# EAGLE design MainBoard (EAGLE 7.7.0)
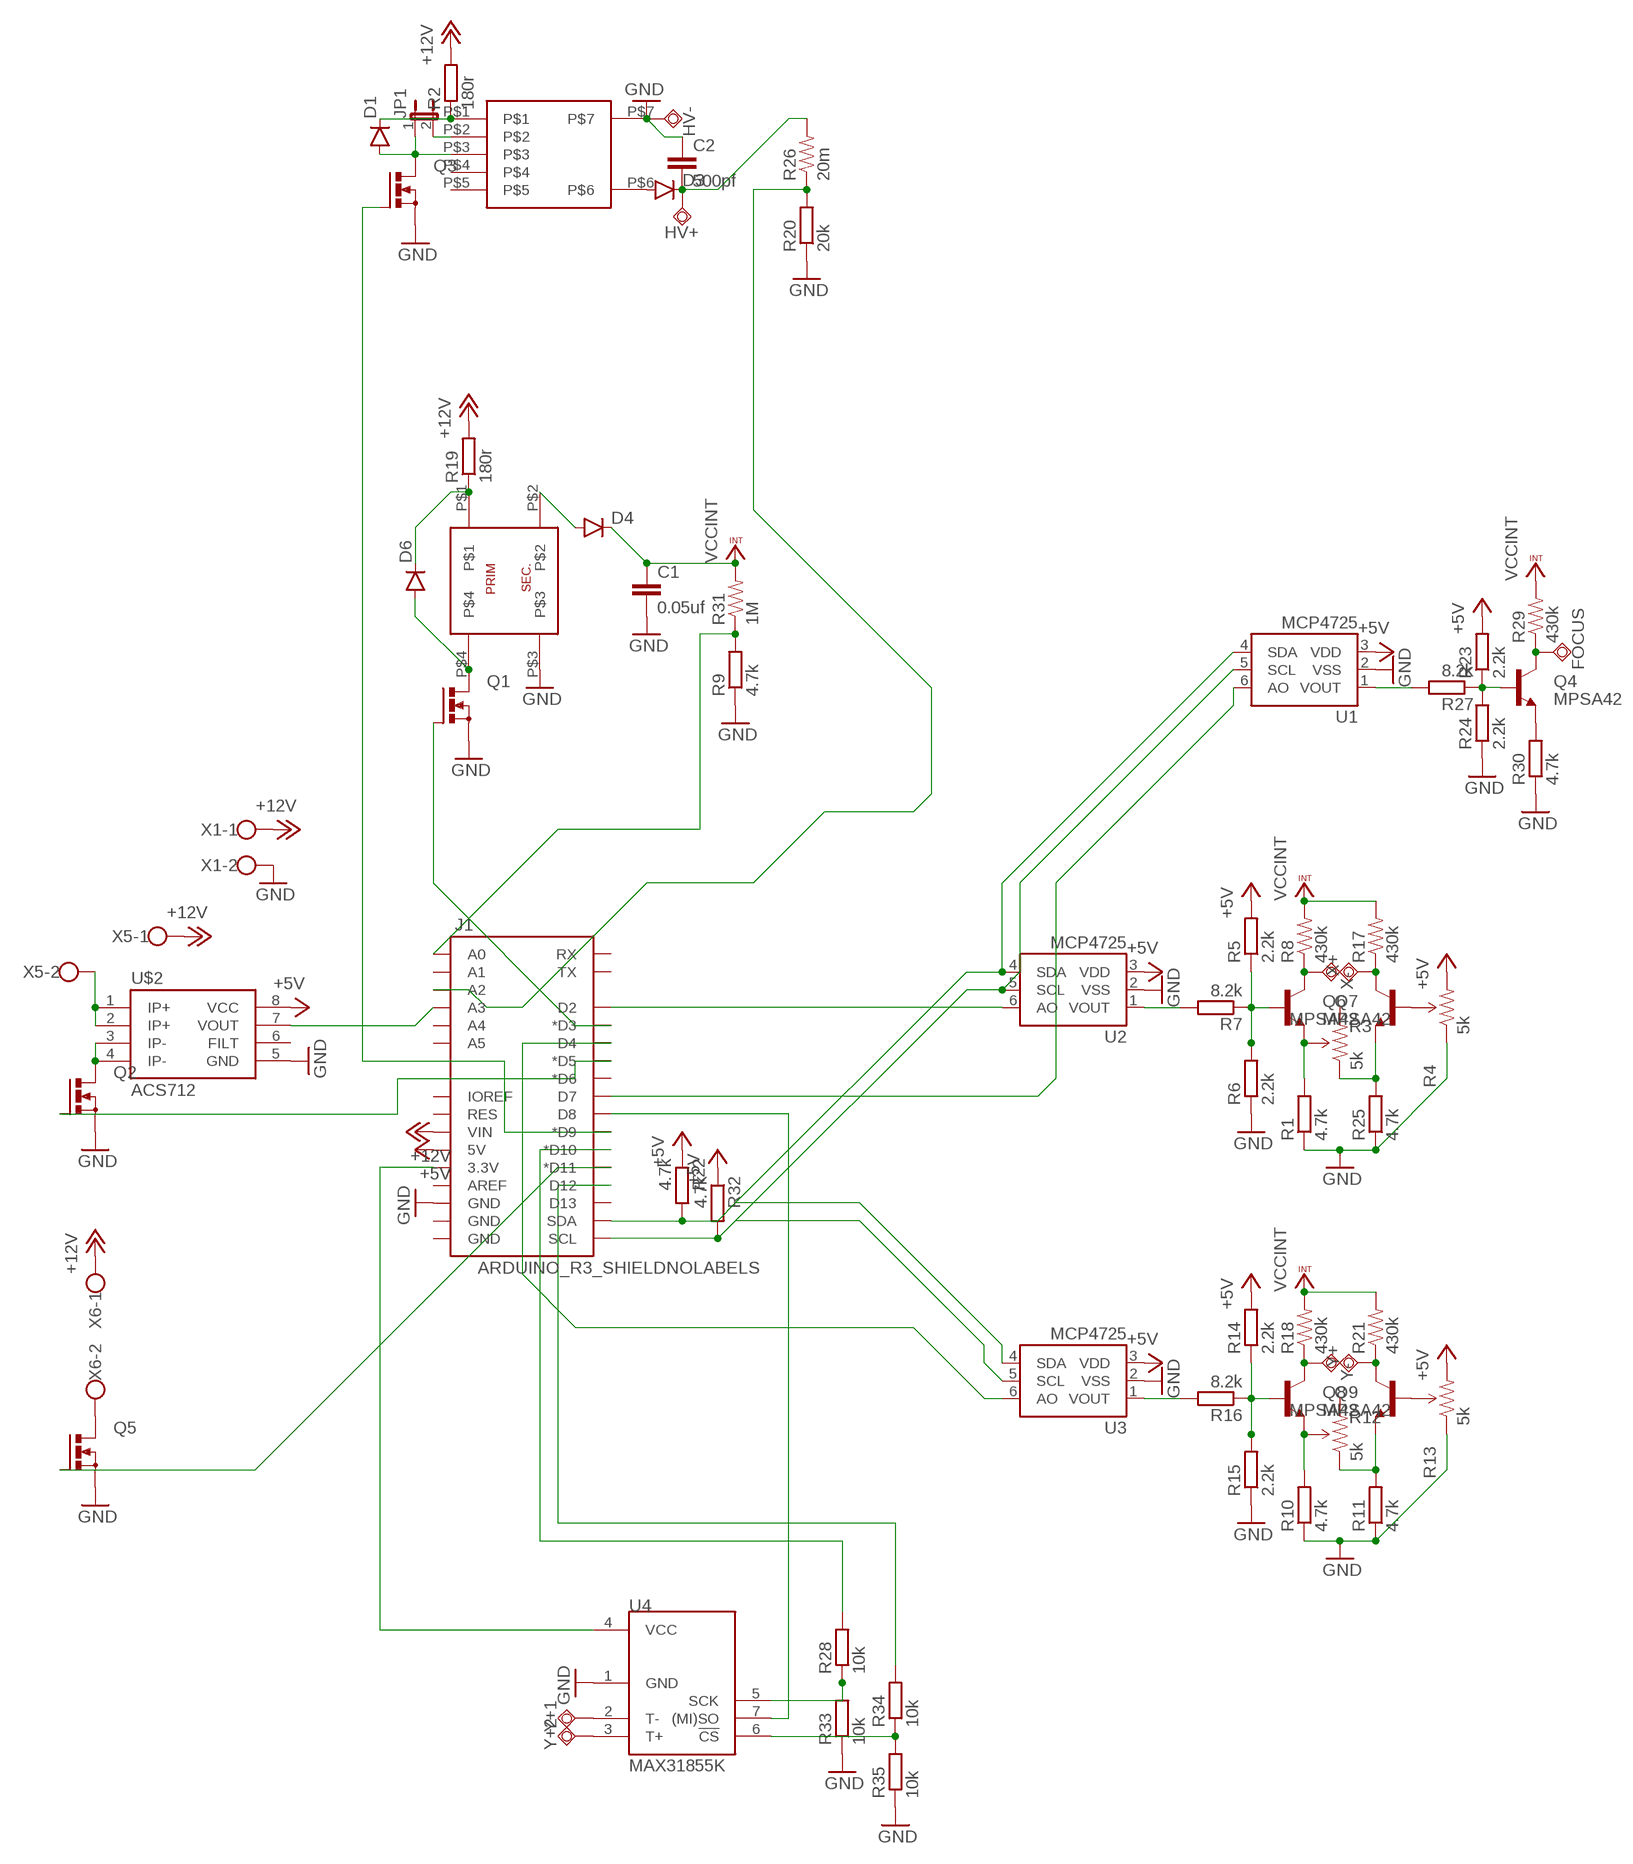
[diagram p0: schematic, sheet 1]

## Parts
C1  0.05uf  CC1206  [C1206]
C2  500pf  CC1206  [C1206]
D1  DIODESOD123  [SOD-123]
D3  DIODEPTH  [DIODE-1N4001]
D4  DIODESOD123  [SOD-123]
D6  DIODESOD123  [SOD-123]
FOCUS  FOCUS  TPSQPAD1-13  [P1-13]
HV+  TPSQPAD1-13  [P1-13]
HV-  TPSQPAD1-13  [P1-13]
J1  ARDUINO_R3_SHIELDNOLABELS  [UNO_R3_SHIELD_NOLABELS]
JP1  JUMPER-2SMD-NO  [SJ_2S-NO]
Q1  N-MOSFET-SO8S  [SO-08]
Q2  N-MOSFET-SO8S  [SO-08]
Q3  N-MOSFET-SO8S  [SO-08]
Q4  MPSA42  TRANSISTOR_NPNMPSA42  [SOT23-3]
Q5  N-MOSFET-SO8S  [SO-08]
Q6  MPSA42  TRANSISTOR_NPNMPSA42  [SOT23-3]
Q7  MPSA42  TRANSISTOR_NPNMPSA42  [SOT23-3]
Q8  MPSA42  TRANSISTOR_NPNMPSA42  [SOT23-3]
Q9  MPSA42  TRANSISTOR_NPNMPSA42  [SOT23-3]
R1  4.7k  R-EU_R0603  [R0603]
R2  180r  R-EU_R0603  [R0603]
R3  5k  TRIMPOTTRIMPOT_PTH_S3_LOCK  [TRIMPOT_PTH_S3_LOCK]
R4  5k  TRIMPOTTRIMPOT_PTH_S3_LOCK  [TRIMPOT_PTH_S3_LOCK]
R5  2.2k  R-EU_R0603  [R0603]
R6  2.2k  R-EU_R0603  [R0603]
R7  8.2k  R-EU_R0603  [R0603]
R8  430k  RESISTOR1206  [1206]
R9  4.7k  R-EU_R0603  [R0603]
R10  4.7k  R-EU_R0603  [R0603]
R11  4.7k  R-EU_R0603  [R0603]
R12  5k  TRIMPOTTRIMPOT_PTH_S3_LOCK  [TRIMPOT_PTH_S3_LOCK]
R13  5k  TRIMPOTTRIMPOT_PTH_S3_LOCK  [TRIMPOT_PTH_S3_LOCK]
R14  2.2k  R-EU_R0603  [R0603]
R15  2.2k  R-EU_R0603  [R0603]
R16  8.2k  R-EU_R0603  [R0603]
R17  430k  RESISTOR1206  [1206]
R18  430k  RESISTOR1206  [1206]
R19  180r  R-EU_R0603  [R0603]
R20  20k  R-EU_R0603  [R0603]
R21  430k  RESISTOR1206  [1206]
R22  4.7k  R-EU_R0603  [R0603]
R23  2.2k  R-EU_R0603  [R0603]
R24  2.2k  R-EU_R0603  [R0603]
R25  4.7k  R-EU_R0603  [R0603]
R26  20m  RESISTORPTH-1/4W  [AXIAL-0.4]
R27  8.2k  R-EU_R0603  [R0603]
R28  10k  R-EU_R0603  [R0603]
R29  430k  RESISTOR1206  [1206]
R30  4.7k  R-EU_R0603  [R0603]
R31  1M  RESISTOR1206  [1206]
R32  4.7k  R-EU_R0603  [R0603]
R33  10k  R-EU_R0603  [R0603]
R34  10k  R-EU_R0603  [R0603]
R35  10k  R-EU_R0603  [R0603]
U1  MCP4725  MCP4725SOT-23  [SOT23-6]
U2  MCP4725  MCP4725SOT-23  [SOT23-6]
U3  MCP4725  MCP4725SOT-23  [SOT23-6]
U4  MAX31855K  [SOIC8]
U$1  ATB  [ATB3225]
U$2  ACS712  [SO08]
U$3  CTX  [CTX]
X1  W237-102  [W237-102]
X5  W237-102  [W237-102]
X6  W237-102  [W237-102]
X+  TPSQPAD1-13  [P1-13]
X-  TPSQPAD1-13  [P1-13]
Y+  TPSQPAD1-13  [P1-13]
Y+1  TPSQPAD1-13  [P1-13]
Y+2  TPSQPAD1-13  [P1-13]
Y-  TPSQPAD1-13  [P1-13]

## Nets
+5V: J1.5V R4.3(CW) R5.2 R13.3(CW) R14.2 R22.1 R23.2 R32.1 U1.3(VDD) U2.3(VDD) U3.3(VDD) U$2.8(VCC)
+12V: J1.VIN R2.2 R19.2 X1.1 X5.1 X6.1
GND: C1.2 C2.1 HV-.TP J1.GND@2(GND) Q1.1(S) Q1.2(S) Q1.3(S) Q2.1(S) Q2.2(S) Q2.3(S) Q3.1(S) Q3.2(S) Q3.3(S) Q5.1(S) Q5.2(S) Q5.3(S) R1.1 R4.1(CCW) R6.1 R9.1 R10.1 R11.1 R13.1(CCW) R15.1 R20.1 R24.1 R25.1 R30.1 R33.1 R35.1 U1.2(VSS) U2.2(VSS) U3.2(VSS) U4.1(GND) U$1.P$3 U$2.5(GND) U$3.P$7 X1.2
N$1 [med]: Q6.3(C) R8.1 X-.TP
N$2 [med]: Q7.3(C) R17.1 X+.TP
N$3: R7.2 U2.1(VOUT)
N$4: Q6.2(E) R1.2 R3.2(WIPER)
N$5: Q7.2(E) R3.1(CCW) R25.2
N$6: Q7.1(B) R4.2(WIPER)
N$7: Q9.1(B) R13.2(WIPER)
N$8: Q6.1(B) R5.1 R6.2 R7.1
N$9: Q4.2(E) R30.2
N$10: J1.D3(*D3) Q1.4(G)
N$11: Q8.2(E) R10.2 R12.2(WIPER)
N$12: Q9.2(E) R11.2 R12.1(CCW)
N$13: J1.SDA R22.2 U1.4(SDA) U2.4(SDA) U3.4(SDA)
N$14: Q8.1(B) R14.1 R15.2 R16.1
N$15 [med]: Q9.3(C) R21.1 Y+.TP
N$16 [med]: Q8.3(C) R18.1 Y-.TP
N$17: R16.2 U3.1(VOUT)
N$18: J1.D2 U2.6(AO)
N$19: J1.D4 U3.6(AO)
N$20: J1.A0 R9.2 R31.1
N$21: D6.A Q1.5(D) Q1.6(D) Q1.7(D) Q1.8(D) U$1.P$4
N$22 [med]: D4.A U$1.P$2
N$23: Q2.5(D) Q2.6(D) Q2.7(D) Q2.8(D) U$2.3(IP-) U$2.4(IP-)
N$24: U$2.1(IP+) U$2.2(IP+) X5.2
N$25: J1.D5(*D5) Q2.4(G)
N$26: D1.A JP1.1 Q3.5(D) Q3.6(D) Q3.7(D) Q3.8(D) U$3.P$3
N$27: JP1.2 U$3.P$2
N$28: D1.C R2.1 U$3.P$1
N$29 [hv]: D3.A U$3.P$6
N$30 [hv]: C2.2 D3.C HV+.TP R26.P$2
N$31: R28.1 R33.2 U4.5(SCK)
N$32: D6.C R19.1 U$1.P$1
N$33: Q4.1(B) R23.1 R24.2 R27.1
N$34: R27.2 U1.1(VOUT)
N$35: J1.SCL R32.2 U1.5(SCL) U2.5(SCL) U3.5(SCL)
N$36: FOCUS.TP Q4.3(C) R29.1
N$37: R34.1 R35.2 U4.6(!CS)
N$38: J1.D9(*D9) Q3.4(G)
N$39: J1.D10(*D10) R28.2
N$40: J1.A2 R20.2 R26.P$1
N$41 [med]: Q5.5(D) Q5.6(D) Q5.7(D) Q5.8(D) X6.2
N$42: J1.D11(*D11) Q5.4(G)
N$43: J1.A3 U$2.7(VOUT)
N$44: J1.D12 R34.2
N$45: J1.D7 U1.6(AO)
N$46: J1.D8 U4.7((MI)SO)
N$47: U4.2(T-) Y+1.TP
N$48: U4.3(T+) Y+2.TP
N$49: J1.3.3V U4.4(VCC)
VCCINT [med]: C1.1 D4.C R8.2 R17.2 R18.2 R21.2 R29.2 R31.2
Unconnected: J1.A1 J1.A4 J1.A5 J1.AREF J1.D6(*D6) J1.D13 J1.GND@0(GND) J1.GND@1(GND) J1.IOREF J1.RES J1.RX J1.TX R3.3(CW) R12.3(CW) U$2.6(FILT) U$3.P$4 U$3.P$5

## Library data of the parts
C1 C2 = eagle-ltspice:C: CAPACITOR, European symbol; SPICEMODEL: NONE; SPICEPREFIX: C
D1 D3 D4 D6 = SparkFun-DiscreteSemi:DIODE: Diode These are standard reverse protection diodes and small signal diodes. SMA package can handle up to about 1A. SOD-323 can handle about 200mA. What the SOD-323 package when ordering, there are some mfgs out there that are 5-pin packages.
FOCUS HV+ HV- X+ X- Y+ Y+1 Y+2 Y- = testpad:TPSQ: Test pad
J1 = SparkFun-Boards:ARDUINO_R3_SHIELD: Shield form compatible with the Arduino Uno R3.
JP1 = SparkFun-Retired:JUMPER-2: Jumper Basic 0.1" spaced jumper. Use with breakaway headers.
Q1-Q3 Q5 = transistor-power:N-MOSFET-SO8: N-Channel MOSFET Example: FDS7760A; N-Channel Logic Level PowerTrench® MOSFET FDS2572; N-Channel UltraFET® Trench MOSFET Source: www.fairchildsemi.com
Q4 Q6-Q9 = SparkFun-DiscreteSemi:TRANSISTOR_NPN: Generic NPN BJT MMBT2222A - TRANS-08049 (SOT-23, 1A 40V) MPSA42 - TRANS-09116 (SOT-23, 500mA 300V) MMBT5088LT1G - TRANS-11160 (SOT-23, 50 mA 30V) BC547 - COM-08928 <http://www.sparkfun.com/products/8928> (TO-92 45V 100mA) (1.Collector 2.Base 3.Emitter) 2N3904 - COM-00521 <http://www.sparkfun.com/products/521> (TO-92 40V 200mA) (1.Emitter 2.Base 3.Collector) P2N2222A - COM-12852 <http://www.sparkfun.com/products/12852> (TO-92 40V 600mA) (1.Collector 2.Base 3.Emitter); PROD_ID: TRANS-09116
R1 R2 R5-R7 R9-R11 R14-R16 R19 R20 R22-R25 R27 R28 R30 R32-R35 = rcl:R-EU_: RESISTOR, European symbol
R3 R4 R12 R13 = SparkFun-Electromechanical:TRIMPOT: Various small potentiometers for "set-and-forget" applications
R8 R17 R18 R21 R26 R29 R31 = SparkFun-Resistors:RESISTOR: Resistor Basic schematic elements and footprints for 0603, 1206, and PTH resistors.
U1-U3 = SparkFun-AnalogIC:MCP4725: Microchip 12-bit I2C DAC, SOT23-6; PROD_ID: IC-08886
U4 = SparkFun-AnalogIC:MAX31855K: Cold-Junction-Compensated K-Thermocoupleto-Digital Converter (-270°C to +1800°C) The MAX31855K performs cold-junction compensation and digitizes the signal from a type-K thermocouple. The data is output in a 14-bit resolution, SPI™-compatible, read-only format. This converter resolves temperatures to 0.25°C, allows readings as high as +1800°C and as low as -270°C, and exhibits thermocouple accuracy of ±2°C for temperatures ranging from -200°C to +700°C for K-type thermocouples.
U$1 = TheLibrary:ATB
U$2 = SparkFun-AnalogIC:ACS712: Hall-effect-based isolated linear current sensor; PROD_ID: IC-08964
U$3 = TheLibrary:CTX
X1 X5 X6 = con-wago-500:W237-102: WAGO SCREW CLAMP; MPN: 237-102; OC_FARNELL: unknown; OC_NEWARK: 70K9898

## Net classes
1 med: width 0.254 mm, clearance 1.27 mm
2 hv: width 0.254 mm, clearance 3.81 mm

## Board
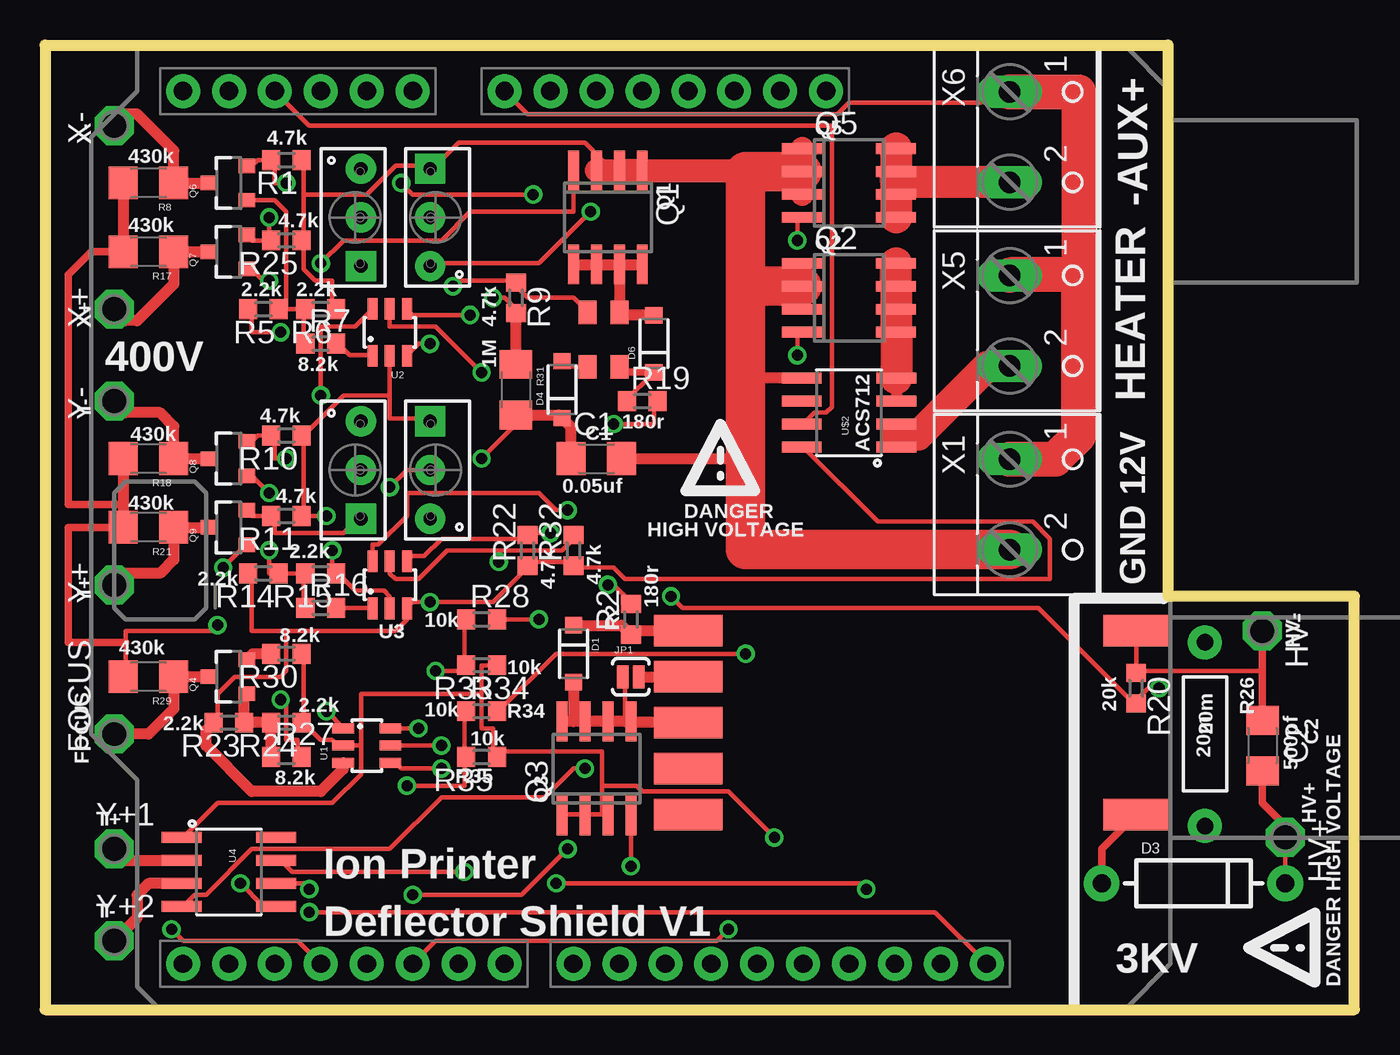
[diagram p1: board, top side]
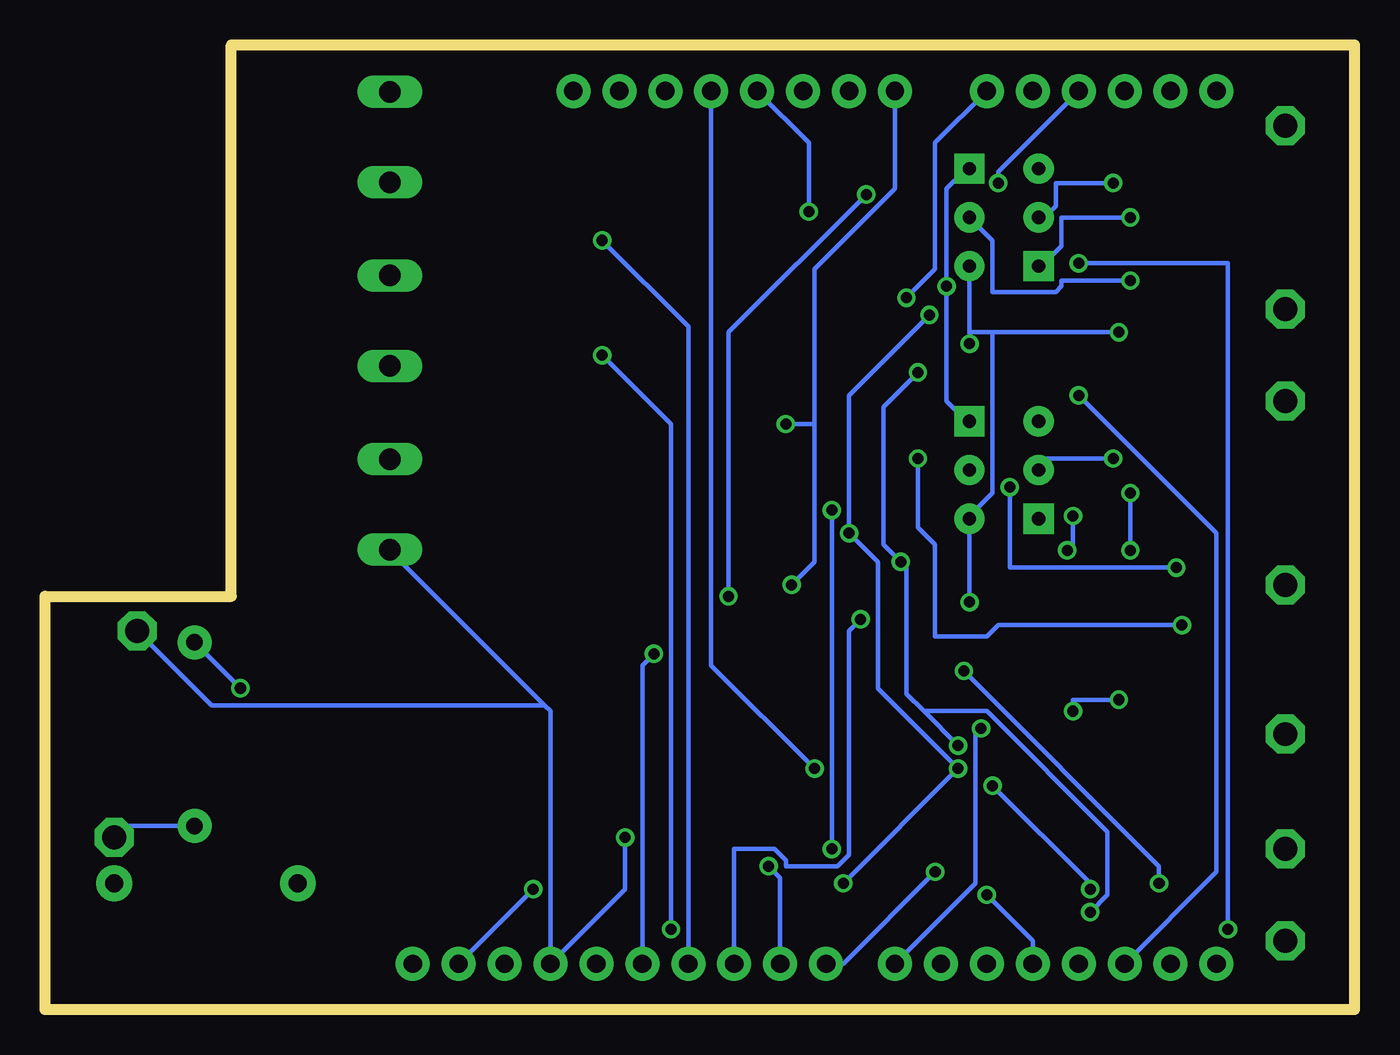
[diagram p2: board, bottom side, seen from below]

Size 72.39 x 53.34 mm. Coordinates in mm from the lower left corner, seen from the top.
Outline: 0,53.34 0,0 72.39,0 72.39,22.86 62.1,22.86 62.1,53.34 0,53.34
Copper layers (1*16): Top 0.035mm / dielectric 1.5mm / Bottom 0.035mm
Design rules "default": minimum track width 10mil, minimum drill 24mil, track to track 8mil, track to pad 8mil, pad to pad 8mil, via to via 8mil, smd to smd 8mil, copper to edge 40mil, drill to drill 8mil, minimum pad ring 10mil, minimum via ring 8mil, stop-mask expansion 4mil, vias tented up to drill 0mil, thermal gap 10mil

### Footprints (pad centres in the part's own frame; a part is rotated, then mirrored left to right if it is on the bottom)
C1206 = smd 1.6 x 1.8: 1 -1.4,0; 2 1.4,0
SOD-123 = smd 0.9 x 0.95: A 1.575,0; C -1.575,0
DIODE-1N4001 = drill 1 pad 1.981: A -5.08,0; C 5.08,0
P1-13 = drill 1.321 pad 2.159 octagon: TP 0,0
UNO_R3_SHIELD_NOLABELS = drill 1.016 pad 1.88: 3.3V 50.8,26.67; 5V 50.8,29.21; A0 50.8,41.91; A1 50.8,44.45; A2 50.8,46.99; A3 50.8,49.53; A4 50.8,52.07; A5 50.8,54.61; AREF 2.54,15.24; D2 2.54,49.53; D3 2.54,46.99; D4 2.54,44.45; D5 2.54,41.91; D6 2.54,39.37; D7 2.54,36.83; D8 2.54,33.02; D9 2.54,30.48; D10 2.54,27.94; D11 2.54,25.4; D12 2.54,22.86; D13 2.54,20.32; GND@0 50.8,31.75; GND@1 50.8,34.29; GND@2 2.54,17.78; IOREF 50.8,21.59; NC 50.8,19.05; RES 50.8,24.13; RX 2.54,54.61; SCL 2.54,10.16; SDA 2.54,12.7; TX 2.54,52.07; VIN 50.8,36.83
SJ_2S-NO = smd 0.635 x 1.27: 1 -0.45,0; 2 0.45,0
SO-08 = smd 0.6 x 2.2: 1 -1.905,-2.6; 2 -0.635,-2.6; 3 0.635,-2.6; 4 1.905,-2.6; 5 1.905,2.6; 6 0.635,2.6; 7 -0.635,2.6; 8 -1.905,2.6
SOT23-3 = smd 0.8 x 0.9: 1 -0.95,-1; 2 0.95,-1; 3 0,1.1
R0603 = smd 1 x 1.1: 1 -0.85,0; 2 0.85,0
TRIMPOT_PTH_S3_LOCK = drill 0.737 pad 1.676 square: 1 -2.692,-0.305 | drill 0.737 pad 1.676: 2 0,-0.305; 3 2.692,-0.305
1206 = smd 1.6 x 1.8: 1 -1.4,0; 2 1.4,0
AXIAL-0.4 = drill 0.9 pad 1.88: P$1 -5.08,0; P$2 5.08,0
SOT23-6 = smd 0.55 x 1.2: 1 0.95,1.3; 2 0,1.3; 3 -0.95,1.3; 4 -0.95,-1.3; 5 0,-1.3; 6 0.95,-1.3
SOIC8 = smd 0.61 x 2.21: 1 -1.905,-2.616; 2 -0.635,-2.616; 3 0.635,-2.616; 4 1.905,-2.616; 5 1.905,2.616; 6 0.635,2.616; 7 -0.635,2.616; 8 -1.905,2.616
ATB3225 = smd 1.3 x 1: P$1 0,0; P$2 0,1.75; P$3 3,1.75; P$4 3,0
SO08 = smd 0.61 x 2.21: 1 -1.905,-2.616; 2 -0.635,-2.616; 3 0.635,-2.616; 4 1.905,-2.616; 5 1.905,2.616; 6 0.635,2.616; 7 -0.635,2.616; 8 -1.905,2.616
CTX = smd 1.74 x 3.8: P$1 0,0; P$2 2.54,0; P$3 5.08,0; P$4 7.62,0; P$5 10.16,0; P$6 10.16,24.85; P$7 0,24.85
W237-102 = drill 1.194 long: 1 -2.5,-1.27; 2 2.5,-1.27

### Placement (x,y rotation side)
C1  30.48,30.48 0 top
C2  67.31,14.6 270 top
D1  29.21,19.69 270 top
D3  63.5,6.98 0 top
D4  28.57,34.29 90 top
D6  33.65,36.83 90 top
FOCUS  3.81,15.24 90 top
HV+  68.58,9.53 270 top
HV-  67.31,20.95 270 top
J1  62.23,0 90 top
JP1  32.38,18.41 0 top
Q1  31.11,43.82 180 top
Q2  44.45,39.37 270 top
Q3  30.48,13.33 0 top
Q4  10.16,18.41 90 top
Q5  44.45,45.72 270 top
Q6  10.16,45.72 90 top
Q7  10.16,41.91 90 top
Q8  10.16,30.48 90 top
Q9  10.16,26.67 90 top
R1  13.34,46.99 180 top
R2  32.38,21.59 90 top
R3  17.14,43.82 90 top
R4  21.59,43.82 270 top
R5  12.07,38.73 180 top
R6  15.24,38.73 180 top
R7  15.24,36.83 0 top
R8  5.71,45.72 180 top
R9  26.04,39.37 270 top
R10  13.34,31.75 180 top
R11  13.34,27.3 180 top
R12  17.14,29.84 90 top
R13  21.59,29.84 270 top
R14  12.07,24.13 180 top
R15  15.24,24.13 180 top
R16  15.24,22.23 0 top
R17  5.71,41.91 180 top
R18  5.71,30.48 180 top
R19  33.02,33.66 0 top
R20  60.32,17.78 270 top
R21  5.71,26.67 180 top
R22  26.67,25.4 90 top
R23  10.16,15.87 180 top
R24  13.34,15.87 180 top
R25  13.34,42.55 180 top
R26  64.14,15.24 270 top
R27  13.34,13.97 0 top
R28  24.13,21.59 0 top
R29  5.71,18.41 180 top
R30  13.34,19.69 180 top
R31  26.04,34.29 270 top
R32  29.21,25.4 90 top
R33  24.13,19.05 180 top
R34  24.13,16.51 0 top
R35  24.13,13.97 180 top
U1  17.78,14.6 90 top
U2  19.05,37.47 180 top
U3  19.05,23.49 180 top
U4  10.16,7.62 270 top
U$1  31.75,35.56 90 top
U$2  44.45,33.02 90 top
U$3  35.56,20.95 270 top
X1  54.61,27.94 270 top
X5  54.61,38.1 270 top
X6  54.61,48.26 270 top
X+  3.81,38.73 90 top
X-  3.81,48.9 90 top
Y+  3.81,23.49 90 top
Y+1  3.81,8.89 0 top
Y+2  3.81,3.81 0 top
Y-  3.81,33.66 90 top

### Tracks (layer width: path | path; a pad name or v marks a point on that pad's centre or on a via)
+5V  (via drill 0.61)
  Top 0.254: v13.02,37.47 11.43,37.47 11.43,38.73 R5.2 | v21.27,36.83 20.64,36.83 20,36.2 U2.3 | v30.16,44.13 27.3,41.27 21.59,41.27 R4.3 | 13.34,20.95 19.37,20.95 20,21.59 20,21.91 U3.3 20,22.23 20.32,22.54 v21.27,22.54 24.77,22.54 26.67,24.45 R22.1 26.67,24.77 29.21,24.77 R32.1 29.21,24.45 31.43,24.45 32.07,23.81 55.56,23.81 55.56,26.03 54.61,26.99 46.04,26.99 41.91,31.12 U$2.8 | 13.34,20.95 11.43,20.95 11.43,24.13 R14.2 | 13.34,20.95 13.34,18.73 13.02,18.41 10.48,18.41 9.53,17.46 9.53,15.87 R23.2
  Top 0.61: U1.3 16.48,13.31 15.24,12.06 11.43,12.06 8.89,14.6 8.89,15.46 R23.2
  Bottom 0.254: 21.27,37.47 20,37.47 | 20,37.47 v13.02,37.47 | 21.27,37.47 21.27,40.96 R4.3 | 21.27,37.47 v21.27,36.83 | 20,37.47 20,28.58 21.27,27.3 R13.3 21.27,26.99 v21.27,22.54 | J1.5V 30.16,47.94 v30.16,44.13
+12V  (via drill 0.61)
  Top 0.254: v31.11,23.49 31.43,23.49 32.38,22.54 R2.2 | v31.43,32.39 33.65,32.39 33.65,33.66 R19.2 | J1.VIN 26.67,49.53 43.81,49.53 44.45,50.16 51.75,50.16 52.39,50.8 X6.1
  Top 1.93: X1.1 55.84,30.44 57.15,31.75 57.15,40.64 | 57.15,40.64 53.38,40.64 X5.1 | X6.1 57.15,50.76 57.15,40.64
  Bottom 0.254: v31.11,23.49 29.84,24.77 29.84,32.39 | 29.84,32.39 29.84,40.96 25.4,45.4 J1.VIN | 29.84,32.39 v31.43,32.39
GND  (via drill 0.61)
  Top 0.254: 14.29,15.87 15.24,14.92 15.88,14.92 16.19,14.6 U1.2 17.46,14.6 | 17.46,14.6 17.46,13.02 15.88,11.43 9.53,11.43 7.62,9.53 U4.1 | U3.2 19.05,22.86 18.73,23.18 17.14,23.18 16.19,24.13 R15.1 15.88,24.13 v15.88,25.4 | 14.29,31.75 14.29,27.3 | 19.05,33.97 19.05,32.7 21.27,32.7 R13.1 | 19.05,33.97 U2.2 | 14.29,31.75 16.51,33.97 19.05,33.97 | 14.29,31.75 R10.1 | 14.29,27.3 v15.56,27.3 | 14.29,27.3 R11.1 | 14.29,42.55 14.29,40.96 14.92,40.32 15.88,40.32 15.88,38.73 R6.1 | 14.29,42.55 14.29,45.09 | 14.29,45.09 14.29,46.99 R1.1 | 14.29,42.55 R25.1 | 14.29,45.09 17.78,45.09 19.37,46.67 21.27,46.67 R4.1 21.59,46.67 22.86,47.94 29.84,47.94 30.8,46.99 30.8,46.41 | 30.16,38.42 U$1.P$3 29.84,38.73 29.21,39.37 26.67,39.37 26.04,40.01 R9.1 26.04,40.32 22.86,40.32 v22.54,40.01 | Q2.3 41.91,38.73 41.91,39.05 Q2.2 41.91,40.96 41.91,41.27 Q2.1 | 60.32,18.73 60.32,20.95 U$3.P$7 | 67.31,18.73 60.32,18.73 | 60.32,18.73 R20.1 | 29.84,10.79 28.57,10.79 Q3.1 | 29.84,10.79 30.8,10.79 | 30.8,10.79 31.11,10.79 Q3.3 | 29.84,10.79 Q3.2 | 14.29,15.87 14.29,19.69 R30.1 | 14.29,15.87 R24.1 | 24.77,14.29 24.77,15.56 24.13,15.56 24.13,17.46 | 24.77,14.29 24.77,13.97 R35.1 24.77,14.29 | 24.13,17.46 24.13,19.05 R33.1 | 17.46,14.6 17.46,17.46 24.13,17.46 | 30.8,12.38 30.8,14.29 24.77,14.29 | 30.8,12.38 30.8,10.79 | v40.32,9.53 37.78,12.06 33.02,12.06 32.7,12.38 30.8,12.38
  Top 0.406: C2.1 67.31,18.73 HV-.TP
  Top 0.61: U$2.5 39.37,34.93 39.37,34.29 38.73,34.29 38.73,35.56 | C1.2 38.73,30.48
  Top 1.27: Q1.3 30.8,46.41 Q1.2 | 39.37,46.36 39.31,46.41 Q1.1 Q1.2 | Q1.2 38.67,46.41 39.37,45.72 | Q5.3 Q5.2 Q5.1
  Top 2.184: X1.2 38.73,25.44 38.73,30.48 38.73,35.56 38.73,40.01 | 38.73,40.01 38.73,46.36 39.37,46.36 Q5.2 | Q2.2 38.73,40.01
  Bottom 0.254: v15.88,25.4 15.56,25.72 v15.56,27.3 | 44.77,16.83 53.34,25.4 X1.2 | 44.77,16.83 44.45,16.51 J1.GND@2 40.32,6.67 v40.32,9.53 | R13.1 21.59,32.7 22.54,33.66 v22.54,40.01 22.54,45.4 21.59,46.36 R4.1 | HV-.TP 63.18,16.83 44.77,16.83
N$1
  Top 0.61: Q6.3 R8.1 7.12,47.5 5.08,49.53 4.45,49.53 X-.TP
N$2
  Top 0.61: X+.TP 4.45,38.1 5.08,38.1 7.12,40.14 R17.1 Q7.3
N$3
  Top 0.254: R7.2 16.19,36.83 16.83,36.2 18.1,36.2 U2.1
N$4  (via drill 0.61)
  Top 0.254: Q6.2 11.43,46.67 11.75,46.99 R1.2 12.7,46.99 12.7,45.72 v13.34,45.72
  Bottom 0.254: v13.34,45.72 16.51,45.72 16.51,44.45 17.14,43.82 R3.2
N$5  (via drill 0.61)
  Top 0.254: 12.38,42.55 11.43,42.55 Q7.2 | v12.38,43.82 12.38,42.55 | 12.38,42.55 R25.2
  Bottom 0.254: v12.38,43.82 16.19,43.82 16.19,42.23 17.14,41.27 R3.1
N$6  (via drill 0.61)
  Top 0.254: v12.38,40.32 12.07,40.32 11.43,40.96 Q7.1
  Bottom 0.254: v12.38,40.32 16.19,40.32 16.19,40.01 16.51,39.69 20,39.69 20,42.55 21.27,43.82 R4.2
N$7  (via drill 0.61)
  Top 0.254: v9.84,24.45 11.11,25.72 Q9.1 | v19.05,28.89 20,29.84 R13.2
  Bottom 0.254: v9.84,24.45 19.05,24.45 v19.05,28.89
N$8
  Top 0.254: 14.29,38.73 14.29,36.83 R7.1 | 13.34,38.73 13.34,44.13 12.7,44.77 11.43,44.77 Q6.1 | 13.34,38.73 R5.1 13.02,38.73 | 13.34,38.73 14.29,38.73 | 14.29,38.73 R6.2
N$9
  Top 0.61: R30.2 11.48,19.69 Q4.2
N$10  (via drill 0.61)
  Top 0.254: Q1.4 29.21,44.13 23.5,44.13 21.91,42.55 16.51,42.55 v15.24,41.27 | v6.99,4.45 7.62,3.81 13.97,3.81 J1.D3
  Bottom 0.254: v15.24,41.27 6.99,41.27 v6.99,4.45
N$11  (via drill 0.61)
  Top 0.254: Q8.2 11.43,31.43 11.75,31.75 R10.2 12.7,31.75 12.7,30.48 v13.34,30.48
  Bottom 0.254: v13.34,30.48 17.14,30.48 17.14,29.84 R12.2
N$12
  Top 0.254: Q9.2 11.43,27.3 R11.2 12.7,27.3 12.7,26.35 16.51,26.35 17.14,26.99 R12.1
N$13  (via drill 0.61)
  Top 0.254: U3.4 20,25.08 20.96,25.08 21.91,26.03 26.67,26.03 R22.2 26.67,26.35 v27.94,26.35 | v21.91,13.33 19.68,13.33 19.37,13.65 U1.4 | v23.5,38.42 20.32,38.42 20,38.73 U2.4 | v45.4,6.67 45.08,6.98 v28.26,6.98
  Bottom 0.254: v23.5,38.42 27.94,33.97 v27.94,26.35 26.35,24.77 26.35,17.78 v21.91,13.33 v28.26,6.98 | v45.4,6.67 J1.SDA
N$14  (via drill 0.61)
  Top 0.254: 14.29,24.13 14.29,22.23 R16.1 | v12.38,28.58 11.43,29.53 Q8.1 | v12.38,25.4 12.38,24.13 R14.1 14.29,24.13 | 14.29,24.13 R15.2
  Bottom 0.254: v12.38,25.4 v12.38,28.58
N$15
  Top 0.61: Q9.3 R21.1 7.12,24.9 6.35,24.13 4.45,24.13 Y+.TP
N$16
  Top 0.61: Q8.3 R18.1 7.12,32.26 6.35,33.02 4.45,33.02 Y-.TP
N$17
  Top 0.254: R16.2 18.1,22.23 U3.1
N$18  (via drill 0.61)
  Top 0.254: v15.24,33.97 15.24,37.78 17.14,37.78 18.1,38.73 U2.6
  Bottom 0.254: v15.24,33.97 7.62,26.35 7.62,7.62 J1.D2
N$19  (via drill 0.61)
  Top 0.254: v28.89,27.62 28.26,27.62 27.3,28.58 20,28.58 20,27.3 18.41,25.72 18.1,25.72 18.1,25.08 U3.6 | v28.89,8.89 26.35,6.35 v20.32,6.35
  Bottom 0.254: v28.89,8.89 v28.89,27.62 | v20.32,6.35 17.78,3.81 J1.D4
N$20  (via drill 0.61)
  Top 0.254: v24.77,39.37 25.4,39.37 26.04,38.73 R9.2
  Top 0.61: R31.1 R9.2
  Bottom 0.254: v24.77,39.37 23.18,40.96 23.18,47.94 J1.A0
N$21
  Top 0.61: D6.A 31.9,38.41 U$1.P$4 Q1.7 | Q1.7 Q1.8 | Q1.5 Q1.6 Q1.7
N$22
  Top 0.254: U$1.P$2 28.57,35.56 D4.A
N$23
  Top 0.61: U$2.4 U$2.3
  Top 1.778: Q2.8 Q2.7 Q2.6 Q2.5 47.07,37.47 U$2.4
N$24
  Top 0.61: U$2.2 47.07,31.75 U$2.1
  Top 1.676: X5.2 52.11,35.6 48.26,31.75 47.07,31.75
N$25  (via drill 0.61)
  Top 0.254: v41.59,36.2 41.59,37.47 Q2.4 | v37.78,4.45 37.15,3.81 21.59,3.81 J1.D5
  Bottom 0.254: v41.59,36.2 37.78,32.39 v37.78,4.45
N$26
  Top 0.254: 32.07,15.94 32.07,18.41 JP1.1
  Top 0.61: U$3.P$3 32.38,15.87 Q3.5 32.07,15.94 Q3.6 Q3.7 29.21,15.94 | 29.21,15.94 Q3.8 | D1.A 29.21,15.94
N$27
  Top 0.61: JP1.2 U$3.P$2
N$28
  Top 0.61: U$3.P$1 32.38,20.95 R2.1 31.86,21.26 D1.C
N$29
  Top 0.406: D3.A 58.42,8.89 60.96,11.43 60.96,11.35 U$3.P$6
N$30
  Top 0.254: HV+.TP 68.58,8.89 D3.C
  Top 0.406: C2.2 67.31,11.43 68.58,10.16 68.58,8.89
  Bottom 0.254: R26.P$2 68.58,10.16 HV+.TP
N$31  (via drill 0.61)
  Top 0.254: 23.18,19.05 23.18,21.59 R28.1 | 23.18,19.05 22.86,18.73 v21.59,18.73 | v10.79,6.98 12.07,5.71 U4.5 | 23.18,19.05 R33.2
  Bottom 0.254: v21.59,18.73 10.79,7.94 v10.79,6.98
N$32
  Top 0.254: D6.C 32.07,33.66 R19.1
  Top 0.406: D6.C 32.05,35.26 U$1.P$1
N$33
  Top 0.61: Q4.1 11.01,17.31 R23.1 R24.2 R27.1
N$34  (via drill 0.61)
  Top 0.254: v13.02,17.15 13.34,17.15 13.34,14.92 13.97,14.92 13.97,13.97 R27.2 | v15.56,16.51 16.51,15.56 U1.1
  Bottom 0.254: v13.02,17.15 15.56,17.15 v15.56,16.51
N$35  (via drill 0.61)
  Top 0.254: 25.08,25.4 22.23,25.4 20.64,23.81 19.37,23.81 19.05,24.13 U3.5 | 25.08,25.4 28.57,25.4 29.21,26.03 R32.2 | v21.91,14.6 U1.5 | 25.08,25.4 v25.08,24.77 | U2.5 19.05,37.78 21.59,37.78 v24.13,35.24 | J1.SCL 49.21,5.4 v14.61,5.4
  Bottom 0.254: 23.81,16.51 24.77,17.46 24.77,24.45 v25.08,24.77 26.04,25.72 26.04,33.34 v24.13,35.24 | 23.81,16.51 v21.91,14.6 | v14.61,5.4 13.65,6.35 13.65,9.84 20.32,16.51 23.81,16.51
N$36
  Top 0.61: Q4.3 R29.1 7.12,16.64 5.71,15.24 FOCUS.TP
N$37  (via drill 0.61)
  Top 0.254: 23.18,13.97 23.18,16.51 R34.1 | 23.18,13.97 23.18,12.38 v20,12.38 | v14.61,6.67 14.29,6.98 U4.6 | 23.18,13.97 R35.2
  Bottom 0.254: v20,12.38 14.61,6.98 v14.61,6.67
N$38  (via drill 0.61)
  Top 0.254: v32.38,7.94 Q3.4
  Bottom 0.254: v32.38,7.94 31.75,7.3 J1.D9
N$39  (via drill 0.61)
  Top 0.254: v27.3,21.59 R28.2
  Bottom 0.254: v27.3,21.59 27.94,20.95 27.94,8.57 28.57,7.94 31.43,7.94 31.43,8.26 32.07,8.89 34.29,8.89 J1.D10
N$40  (via drill 0.61)
  Top 0.254: 60.32,17.15 60.96,17.78 v61.59,17.78 | v19.68,45.72 20.32,45.09 v26.99,45.09 | v34.61,22.86 35.24,22.23 54.93,22.23 60.01,17.15 60.32,17.15 | 60.32,17.15 R20.2
  Bottom 0.254: R26.P$1 v61.59,17.78 | J1.A2 19.68,46.36 v19.68,45.72 | v26.99,45.09 34.61,37.47 v34.61,22.86
N$41
  Top 1.778: X6.2 47.05,45.76 | 47.05,45.76 Q5.7 Q5.8 | 47.05,45.76 Q5.6 Q5.5
N$42  (via drill 0.61)
  Top 0.254: v41.59,42.55 41.59,43.82 Q5.4
  Bottom 0.254: v41.59,42.55 36.83,37.78 J1.D11
N$43
  Top 0.254: J1.A3 14.61,48.9 43.5,48.9 43.5,33.34 43.18,33.02 42.54,33.02 41.91,32.39 U$2.7
N$44  (via drill 0.61)
  Top 0.254: v38.73,19.69 28.26,19.69 25.08,16.51 R34.2
  Bottom 0.254: v38.73,19.69 39.37,19.05 J1.D12
N$45  (via drill 0.61)
  Top 0.254: v20.64,15.56 19.37,15.56 U1.6
  Bottom 0.254: v20.64,15.56 20.96,15.24 20.96,6.98 J1.D7
N$46  (via drill 0.61)
  Top 0.254: v23.18,7.62 13.65,7.62 13.02,8.26 U4.7
  Bottom 0.254: v23.18,7.62 28.26,2.54 J1.D8
N$47
  Top 0.61: Y+1.TP 3.81,8.26 U4.2
N$48
  Top 0.61: U4.3 5.71,6.98 5.08,6.35 5.08,5.08 Y+2.TP
N$49  (via drill 0.61)
  Top 0.254: v29.84,13.33 29.21,13.33 27.62,11.75 21.91,11.75 19.05,8.89 11.43,8.89 8.89,6.35 8.26,6.35 7.62,5.71 U4.4
  Bottom 0.254: v29.84,13.33 35.56,19.05 J1.3.3V
VCCINT  (via drill 0.61)
  Top 0.254: v9.53,21.27 9.21,20.95 4.45,20.95 4.45,20.32 4.45,18.41 R29.2 | v24.13,30.48 26.35,32.7 R31.2
  Top 0.406: R17.2 2.54,41.91 1.27,40.64 1.27,27.94 4.31,27.94 | R21.2 1.27,26.67 1.27,20.32 4.45,20.32
  Top 0.61: R18.2 4.31,27.94 R21.2 | R8.2 R17.2 | R31.2 28.4,32.89 D4.C 29.08,32.21 C1.1
  Bottom 0.254: v9.53,21.27 19.68,21.27 20.32,20.64 23.18,20.64 23.18,25.72 24.13,26.67 v24.13,30.48

### Text on the board
_tsilk: 4.7k | X- | 430k | Q5 | Q1 | -AUX+ | 430k | 4.7k | Q2 | 2.2k | 2.2k | 4.7k | X+ | 1M | 400V | 8.2k | HEATER | Y- | 4.7k | 430k | C1 | 180r | ACS712 | 430k | 4.7k | 0.05uf | 12V | DANGER | 2.2k | HIGH VOLTAGE | 2.2k | 4.7k | GND | Y+ | 4.7k | 10k | 180r | HV- | 430k | U3 | R2 | 8.2k | 10k | 20k | 2.2k | 10k | 2.2k | R34 | 20m | 500pf | C2 | 10k | FOCUS | 8.2k | R35 | HV+ | Q3 | T+ | Ion Printer | T- | Deflector Shield V1 | 3KV | DANGER HIGH VOLTAGE